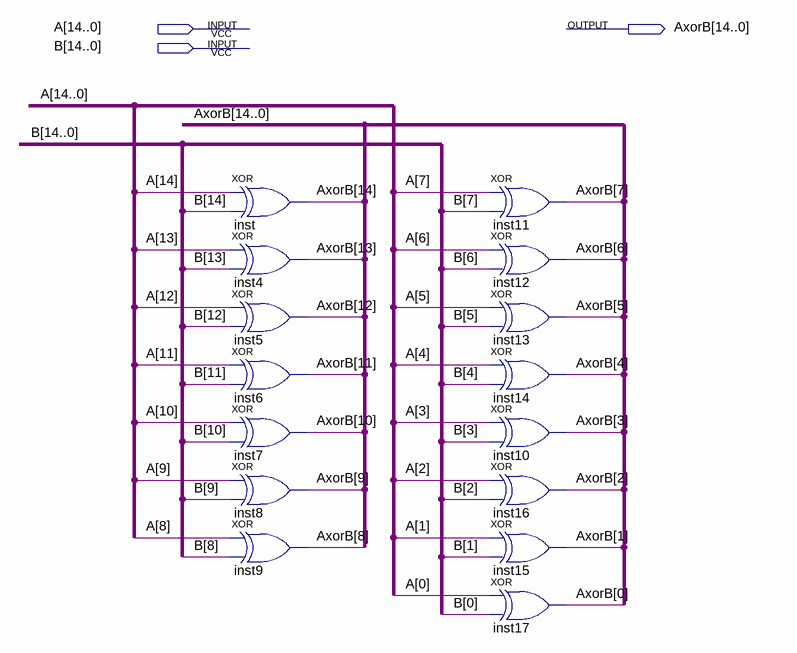
[diagram p0: schematic sheet]
// Quartus schematic lpm_xor.bdf as structural Verilog: 15 symbols, 3 pins
module lpm_xor (
  input  [14:0] A,
  input  [14:0] B,
  output [14:0] AxorB
);

  xor inst (AxorB[14], A[14], B[14]);
  xor inst4 (AxorB[13], A[13], B[13]);
  xor inst5 (AxorB[12], A[12], B[12]);
  xor inst6 (AxorB[11], A[11], B[11]);
  xor inst7 (AxorB[10], A[10], B[10]);
  xor inst8 (AxorB[9], A[9], B[9]);
  xor inst9 (AxorB[8], A[8], B[8]);
  xor inst11 (AxorB[7], A[7], B[7]);
  xor inst12 (AxorB[6], A[6], B[6]);
  xor inst13 (AxorB[5], A[5], B[5]);
  xor inst14 (AxorB[4], A[4], B[4]);
  xor inst10 (AxorB[3], A[3], B[3]);
  xor inst16 (AxorB[2], A[2], B[2]);
  xor inst15 (AxorB[1], A[1], B[1]);
  xor inst17 (AxorB[0], A[0], B[0]);
endmodule
